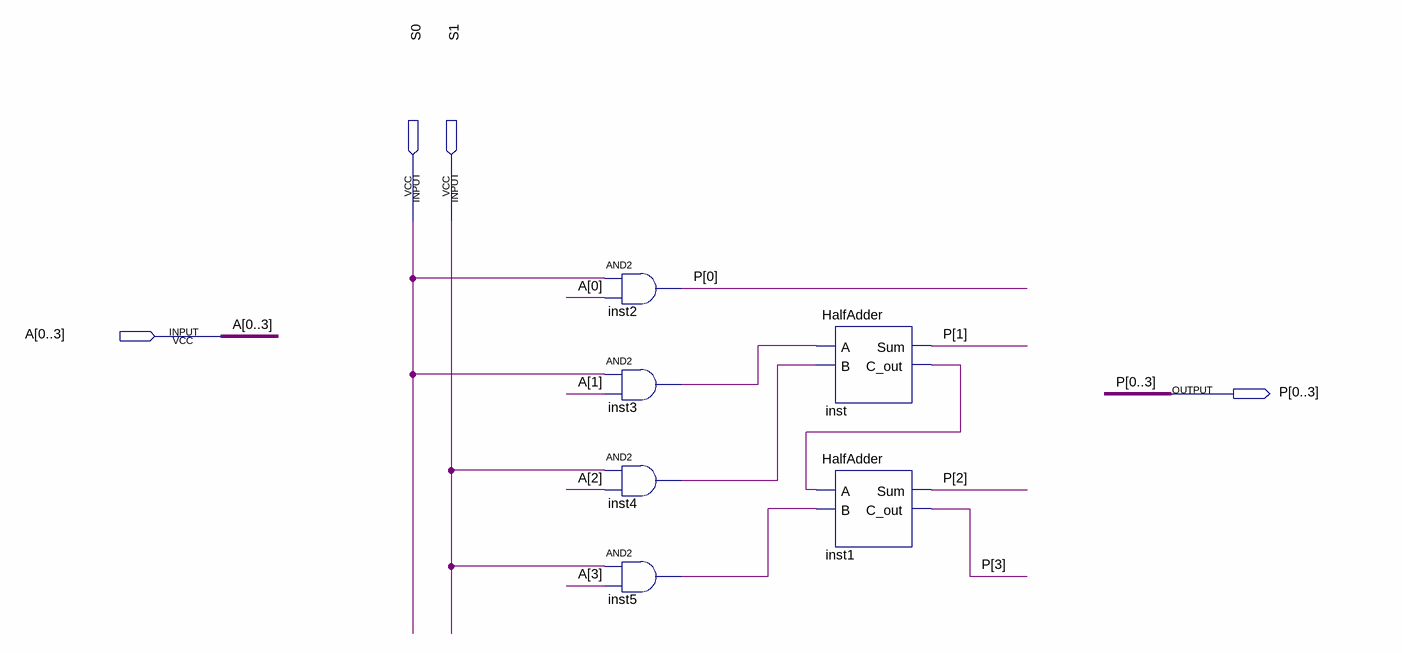
[diagram p0: schematic sheet]
// Quartus schematic AmultiplyB.bdf as structural Verilog: 6 symbols, 4 pins
module AmultiplyB (
  input  S0,
  input  S1,
  input  [0:3] A,
  output [0:3] P
);

  wire inst3_out, inst4_out, inst5_out, inst_c_out;

  and inst2 (P[0], S0, A[0]);
  and inst3 (inst3_out, S0, A[1]);
  and inst4 (inst4_out, S1, A[2]);
  and inst5 (inst5_out, S1, A[3]);
  HalfAdder inst (.A(inst3_out), .B(inst4_out), .Sum(P[1]), .C_out(inst_c_out));
  HalfAdder inst1 (.A(inst_c_out), .B(inst5_out), .Sum(P[2]), .C_out(P[3]));
endmodule
